# Altium schematic sheet Crystal.SchDoc
size A4; SheetNumber: 5; SheetTotal: 6
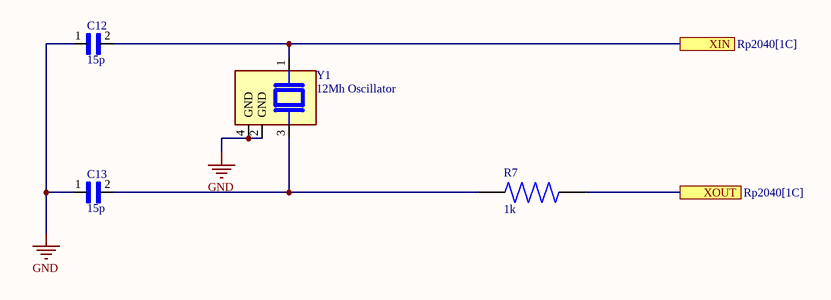
[diagram p0: Crystal.SchDoc]

## Parts
C12  15p  [SMD Capacator]
C13  15p  [SMD Capacator]
R7  1k  [SMD Resistor]
Y1  12Mh Oscillator  [12Mh Oscillator]

## Ports
XIN (see Rp2040[1C]), XOUT (see Rp2040[1C])

## Nets
GND: C12.1 C13.1 Y1.2(GND) Y1.4(GND)
XIN: C12.2 Y1.1 ; port XIN
XOUT: R7.2 ; port XOUT
NetC13_2: C13.2 R7.1 Y1.3

## Library data of the parts
C12 C13 = SMD Capacator
R7 = SMD Resistor